# Altium schematic sheet Microcontroller.SchDoc
size A4; SheetNumber: 2; SheetTotal: 5
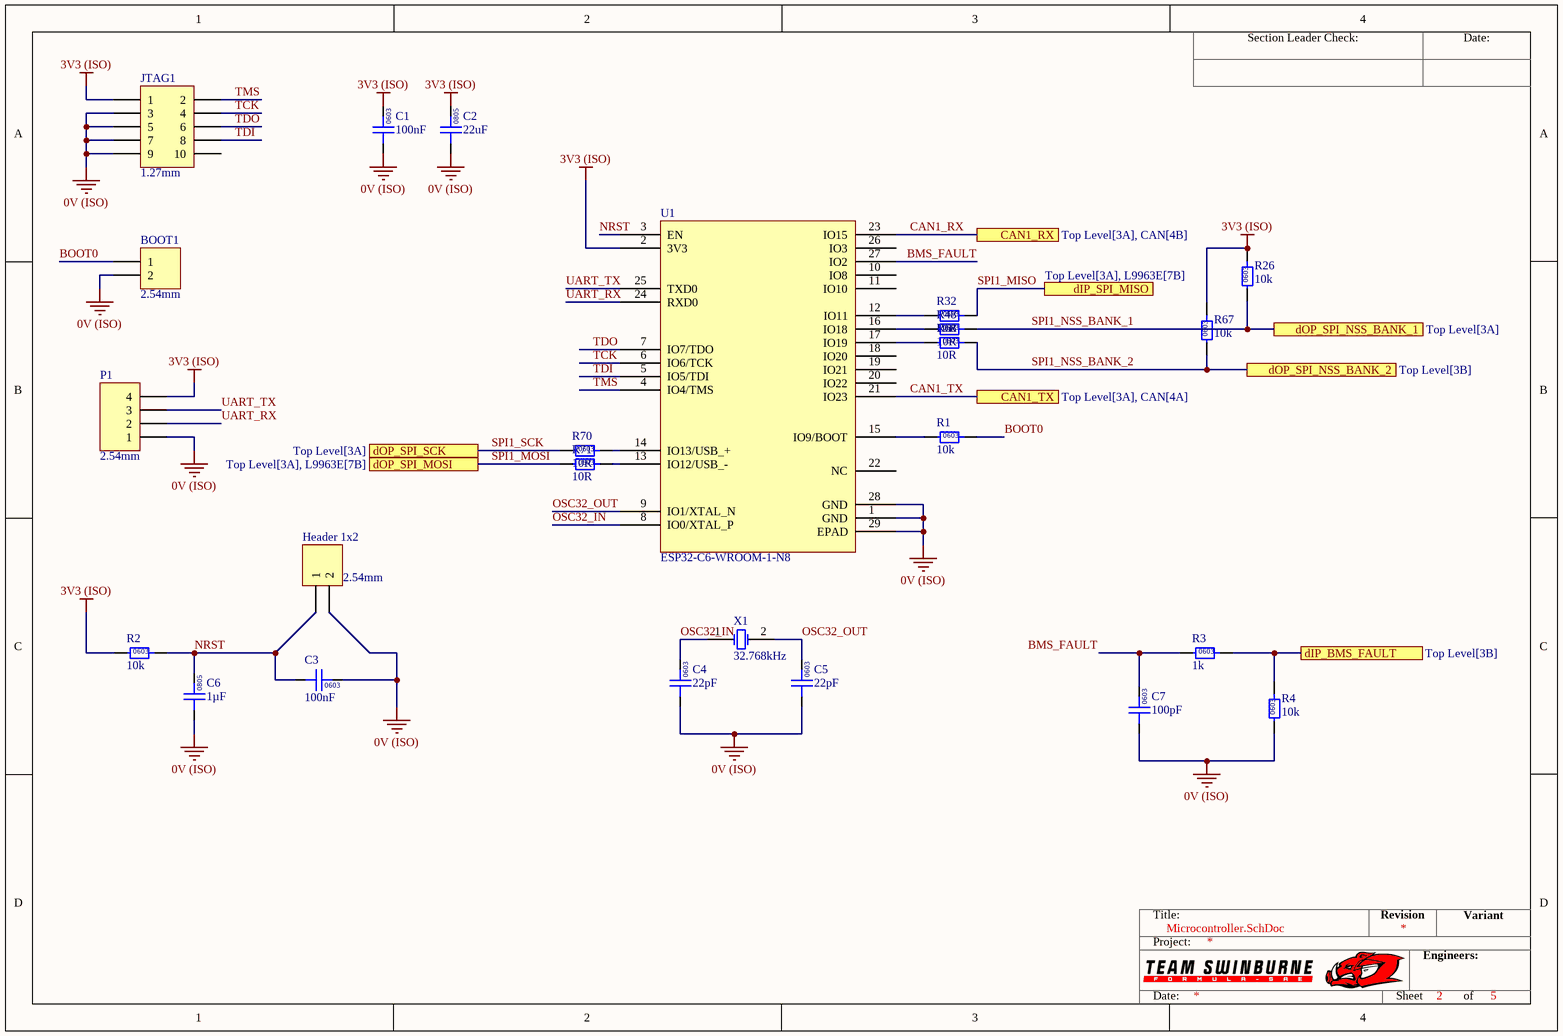
[diagram p0: Microcontroller.SchDoc]

## Parts
BOOT1  2.54mm  [TH 2.54mm Header 1x2]
C1  100nF  [0603]
C2  22uF  [0805]
C3  100nF  [0603]
C4  22pF  [0603]
C5  22pF  [0603]
C6  1µF  [0805]
C7  100pF  [0603]
Header_1x2  2.54mm  [TH 2.54mm Header 1x2]
JTAG1  1.27mm  [3221-10-0300-00]
P1  2.54mm  [TH 2.54mm Header 1x4]
R1  10k  [0603]
R2  10k  [0603]
R3  1k  [0603]
R4  10k  [0603]
R26  10k  [0603]
R32  10R  [0603]
R48  10R  [0603]
R67  10k  [0603]
R68  10R  [0603]
R70  10R  [0603]
R71  10R  [0603]
U1  ESP32-C6-WROOM-1-N8  [ESP32-C6-WROOM-1-N8]
X1  32.768kHz  [EPSON 2-SMD]

## Ports
CAN1_RX (see Top Level[3A], CAN[4B]), CAN1_TX (see Top Level[3A], CAN[4A]), dIP_BMS_FAULT (see Top Level[3B]), dIP_SPI_MISO (see Top Level[3A], L9963E[7B]), dOP_SPI_MOSI (see Top Level[3A], L9963E[7B]), dOP_SPI_NSS_BANK_1 (see Top Level[3A]), dOP_SPI_NSS_BANK_2 (see Top Level[3B]), dOP_SPI_SCK (see Top Level[3A])

## Nets
0V (ISO): BOOT1.2 C1.1 C2.1 C3.2 C4.1 C5.1 C6.1 C7.1 Header_1x2.2 JTAG1.3 JTAG1.5 JTAG1.7 JTAG1.9 P1.1 R4.1 U1.1(GND) U1.28(GND) U1.29(EPAD)
3V3 (ISO): C1.2 C2.2 JTAG1.1 P1.4 R2.1 R26.2 R67.2 U1.2(3V3)
BMS_FAULT: C7.2 R3.1 U1.27(IO2)
BOOT0: BOOT1.1 R1.2
CAN1_RX: U1.23(IO15) ; port CAN1_RX
CAN1_TX: U1.21(IO23) ; port CAN1_TX
dIP_BMS_FAULT: R3.2 R4.2 ; port dIP_BMS_FAULT
NRST: C3.1 C6.2 Header_1x2.1 R2.2 U1.3(EN)
OSC32_IN: C4.2 U1.8(IO0/XTAL_P) X1.1(OSC1)
OSC32_OUT: C5.2 U1.9(IO1/XTAL_N) X1.2(OSC2)
SPI1_MISO: R32.2 ; port dIP_SPI_MISO
SPI1_MOSI: R71.1 ; port dOP_SPI_MOSI
SPI1_NSS_BANK_1: R26.1 R48.2 ; port dOP_SPI_NSS_BANK_1
SPI1_NSS_BANK_2: R67.1 R68.2 ; port dOP_SPI_NSS_BANK_2
SPI1_SCK: R70.1 ; port dOP_SPI_SCK
TCK: JTAG1.4 U1.6(IO6/TCK)
TDI: JTAG1.8 U1.5(IO5/TDI)
TDO: JTAG1.6 U1.7(IO7/TDO)
TMS: JTAG1.2 U1.4(IO4/TMS)
UART_RX: P1.2 U1.24(RXD0)
UART_TX: P1.3 U1.25(TXD0)
NetR1_1: R1.1 U1.15(IO9/BOOT)
NetR32_1: R32.1 U1.12(IO11)
NetR48_1: R48.1 U1.16(IO18)
NetR68_1: R68.1 U1.17(IO19)
NetR70_2: R70.2 U1.14(IO13/USB_+)
NetR71_2: R71.2 U1.13(IO12/USB_-)

Not connected (* = marked no-connect by the designer): JTAG1 10; U1 10(IO8) 11(IO10) 18(IO20) 19(IO21) 20(IO22) 22(NC) 26(IO3)

## Notes on the sheet
- Section Leader Check:
- Date:
- Title:
- Revision
- Variant
- Project:
- Engineers:
- Sheet
- of
- (in symbol GCM21BR71H105KA03L) 0805
- (in symbol GCM188L81H104KA57D) 0603
- (in symbol GRM21BR61A226ME51L) 0805
- (in symbol GRM0335C1H220JA01D) 0603
- (in symbol GRM1885C1H101JA01D) 0603
- (in symbol RC0603FR-071KL) 0603
- (in symbol RC0603FR-0710KL) 0603
- (in symbol RC0603FR-0710RL) 0603

## Library data of the parts
BOOT1 Header_1x2 = TH 2.54mm Header 1x2: Positions: 2; Angle: 0; Flange: No; Contact: NA; Part Number: TH 2.54mm Header 1x2; Pitch: 2.54mm; Row Spacing: 2.54mm
C1 C3 = GCM188L81H104KA57D: Manufacturer: muRata; Rated Voltage: 50V; Tolerance: ±10%; Material: MLCC; Temperature Rating: X8L; Part Number: GCM188L81H104KA57D; Value: 100nF; Digikey Part Number: 490-6049-1-ND
C2 = GRM21BR61A226ME51L: Manufacturer: muRata; Rated Voltage: 50V; Tolerance: 20%; Material: MLCC; Temperature Rating: X5R; Part Number: GRM21BR61A226ME51L; Value: 22uF; Digikey Part Number: 490-10511-1-ND
C4 C5 = GRM0335C1H220JA01D: Manufacturer: Murata Electronics; Rated Voltage: 50V; Tolerance: ±5%; Material: MLCC; Temperature Rating: C0G, NP0; Part Number: GRM0335C1H220JA01D; Value: 22pF; Digikey Part Number: 490-6123-1-ND
C6 = GCM21BR71H105KA03L: Manufacturer: muRata; Rated Voltage: 50V; Tolerance: ±10%; Material: MLCC; Temperature Rating: X7R; Part Number: GCM21BR71H105KA03L; Value: 1µF; Digikey Part Number: 490-10675-1-ND
C7 = GRM1885C1H101JA01D: Manufacturer: Murata Electronics; Rated Voltage: 50V; Tolerance: ±5%; Material: MLCC; Temperature Rating: C0G, NP0; Part Number: GRM1885C1H101JA01D; Value: 100pF; Digikey Part Number: 490-1427-1-ND
JTAG1 = SMD 1.27mm Header 2x5 (3221-10-0300-00): Positions: 10; Angle: 0; Flange: No; Contact: NA; Part Number: SMD 1.27mm Header 2x5 (3221-10-0300-00); Pitch: 1.27mm; Row Spacing: 1.27mm
P1 = TH 2.54mm Header 1x4: Positions: 4; Angle: 0; Flange: No; Contact: NA; Part Number: TH 2.54mm Header 1x4; Pitch: 2.54mm; Row Spacing: 2.54mm
R1 R2 R4 R26 R67 = RC0603FR-0710KL: Manufacturer: YAGEO; Tolerance: 0.01; Rated Power: 0.1W; Part Number: RC0603FR-0710KL; Value: 10k; Material: FR-07; Digikey Part Number: 311-10.0KHRCT-ND
R3 = RC0603FR-071KL: Manufacturer: YAGEO; Tolerance: 0.01; Rated Power: 0.1W; Part Number: RC0603FR-071KL; Value: 1k; Material: FR-07; Digikey Part Number: 311-1.00KHRCT-ND
R32 R48 R68 R70 R71 = RC0603FR-0710RL: Manufacturer: YAGEO; Tolerance: 0.01; Rated Power: 0.1W; Part Number: RC0603FR-0710RL; Value: 10R; Material: FR-07; Digikey Part Number: 311-10.0HRCT-ND
U1 = ESP32-C6-WROOM-1-N8: RF TXRX MOD BT WIFI PCB TH SMD; Manufacturer: Espressif; Complex IC: 1; Part Number: ESP32-C6-WROOM-1-N8
X1 = FC-135 32.7680KA-A5: Manufacturer: EPSON; Load Capacitance: 12.5pF; ESR: 70k; Part Number: FC-135 32.7680KA-A5; Value: 32.768kHz; Digikey Part Number: SER4103TR-ND; Digikey Link: https://www.digikey.com/product-detail/en/epson/FC-135-32.7680KA-A5/SER4103TR-ND/5259895